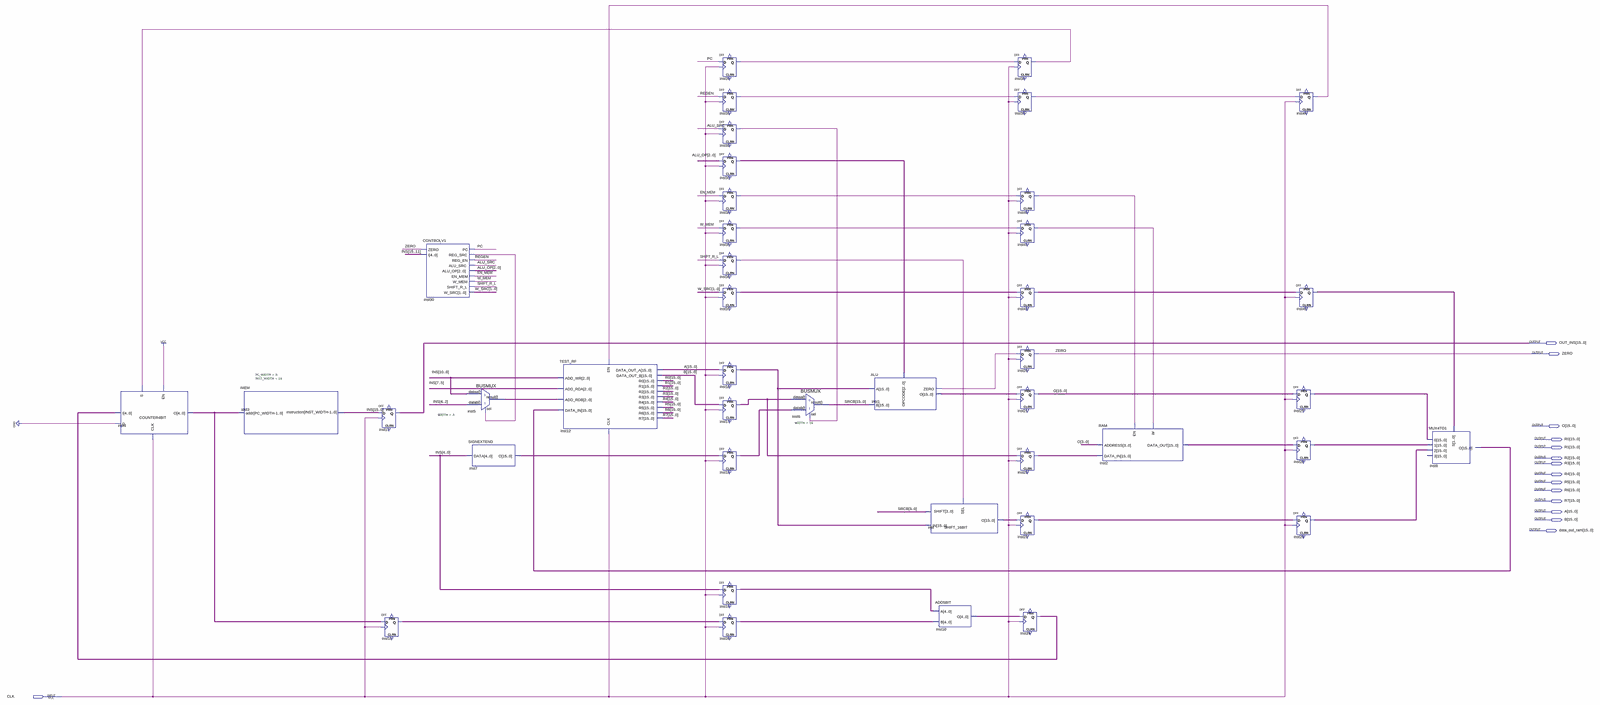
[diagram p0: schematic sheet, whole]
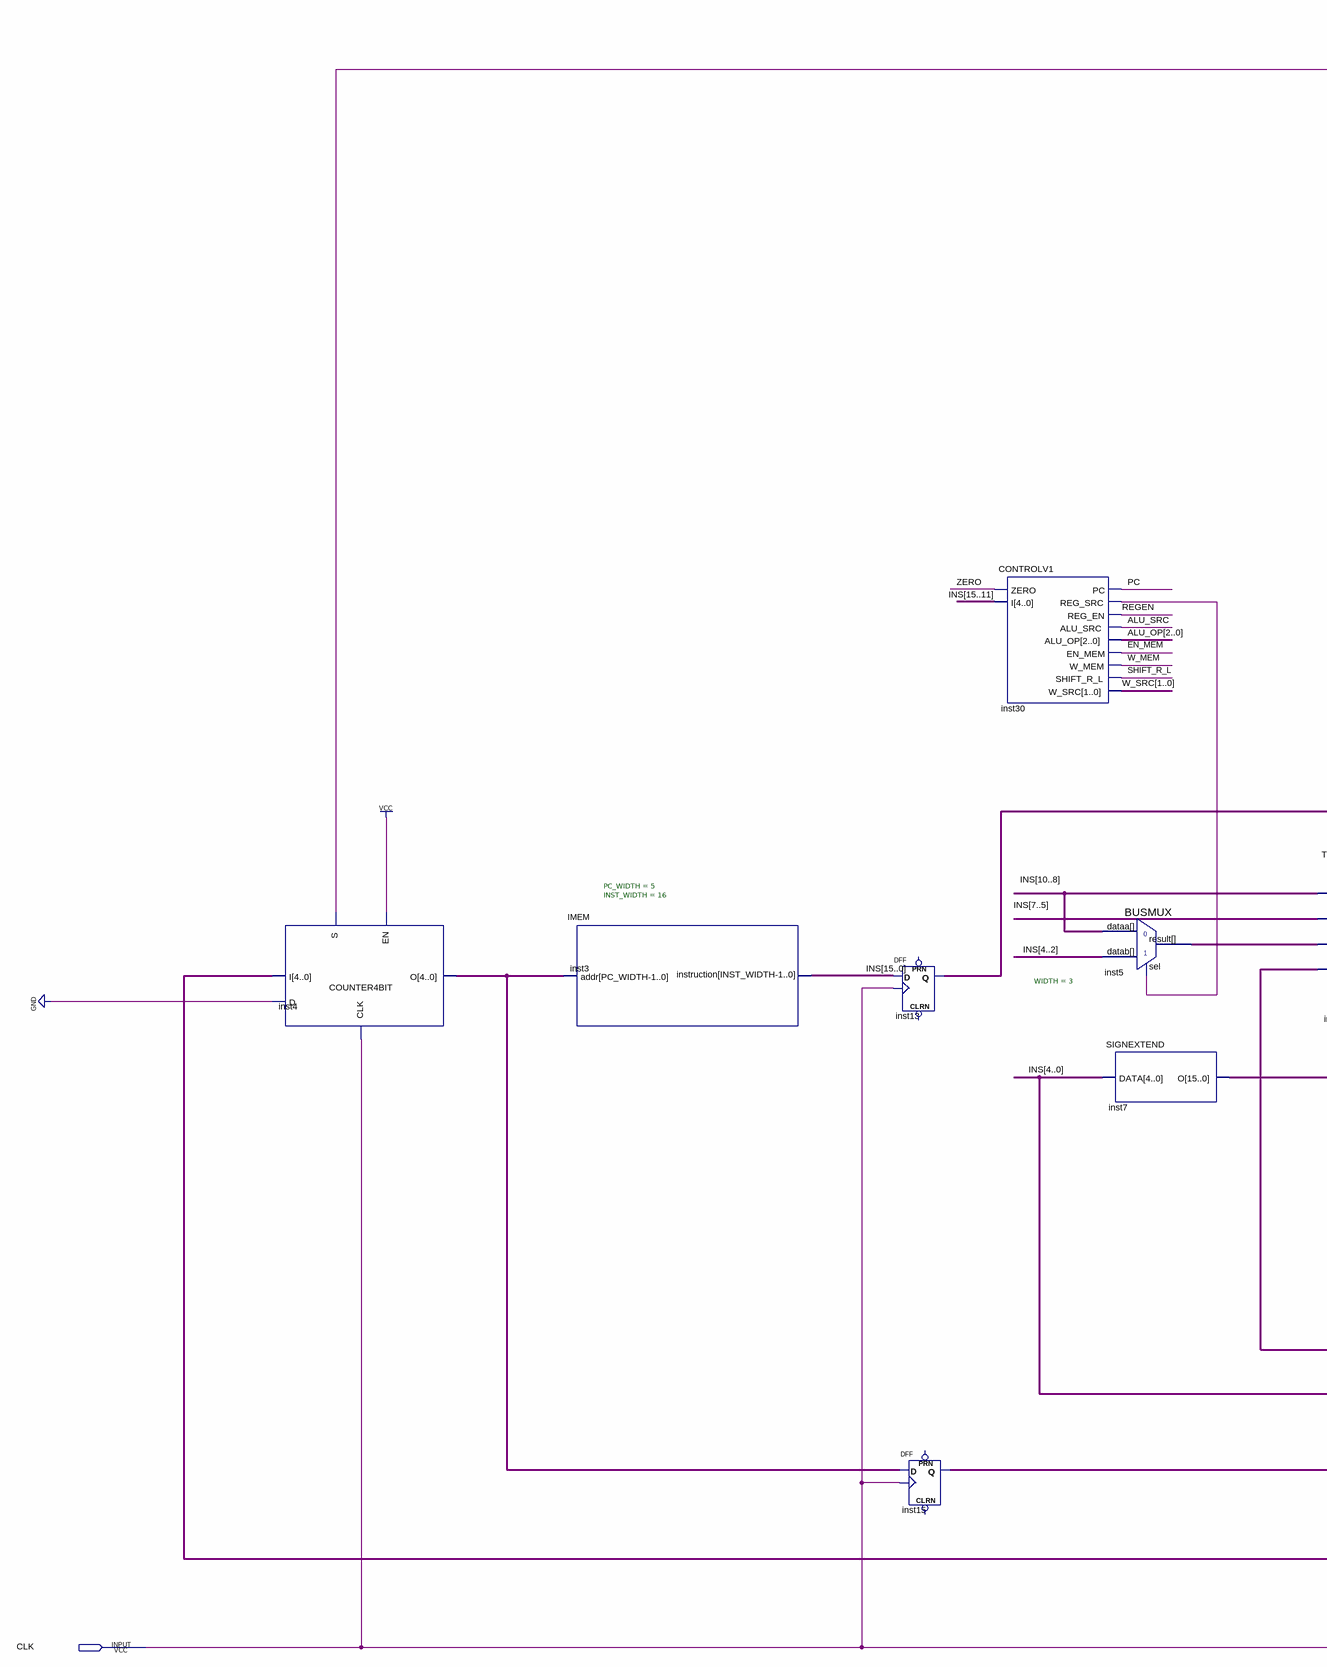
[diagram p1: schematic sheet, left part]
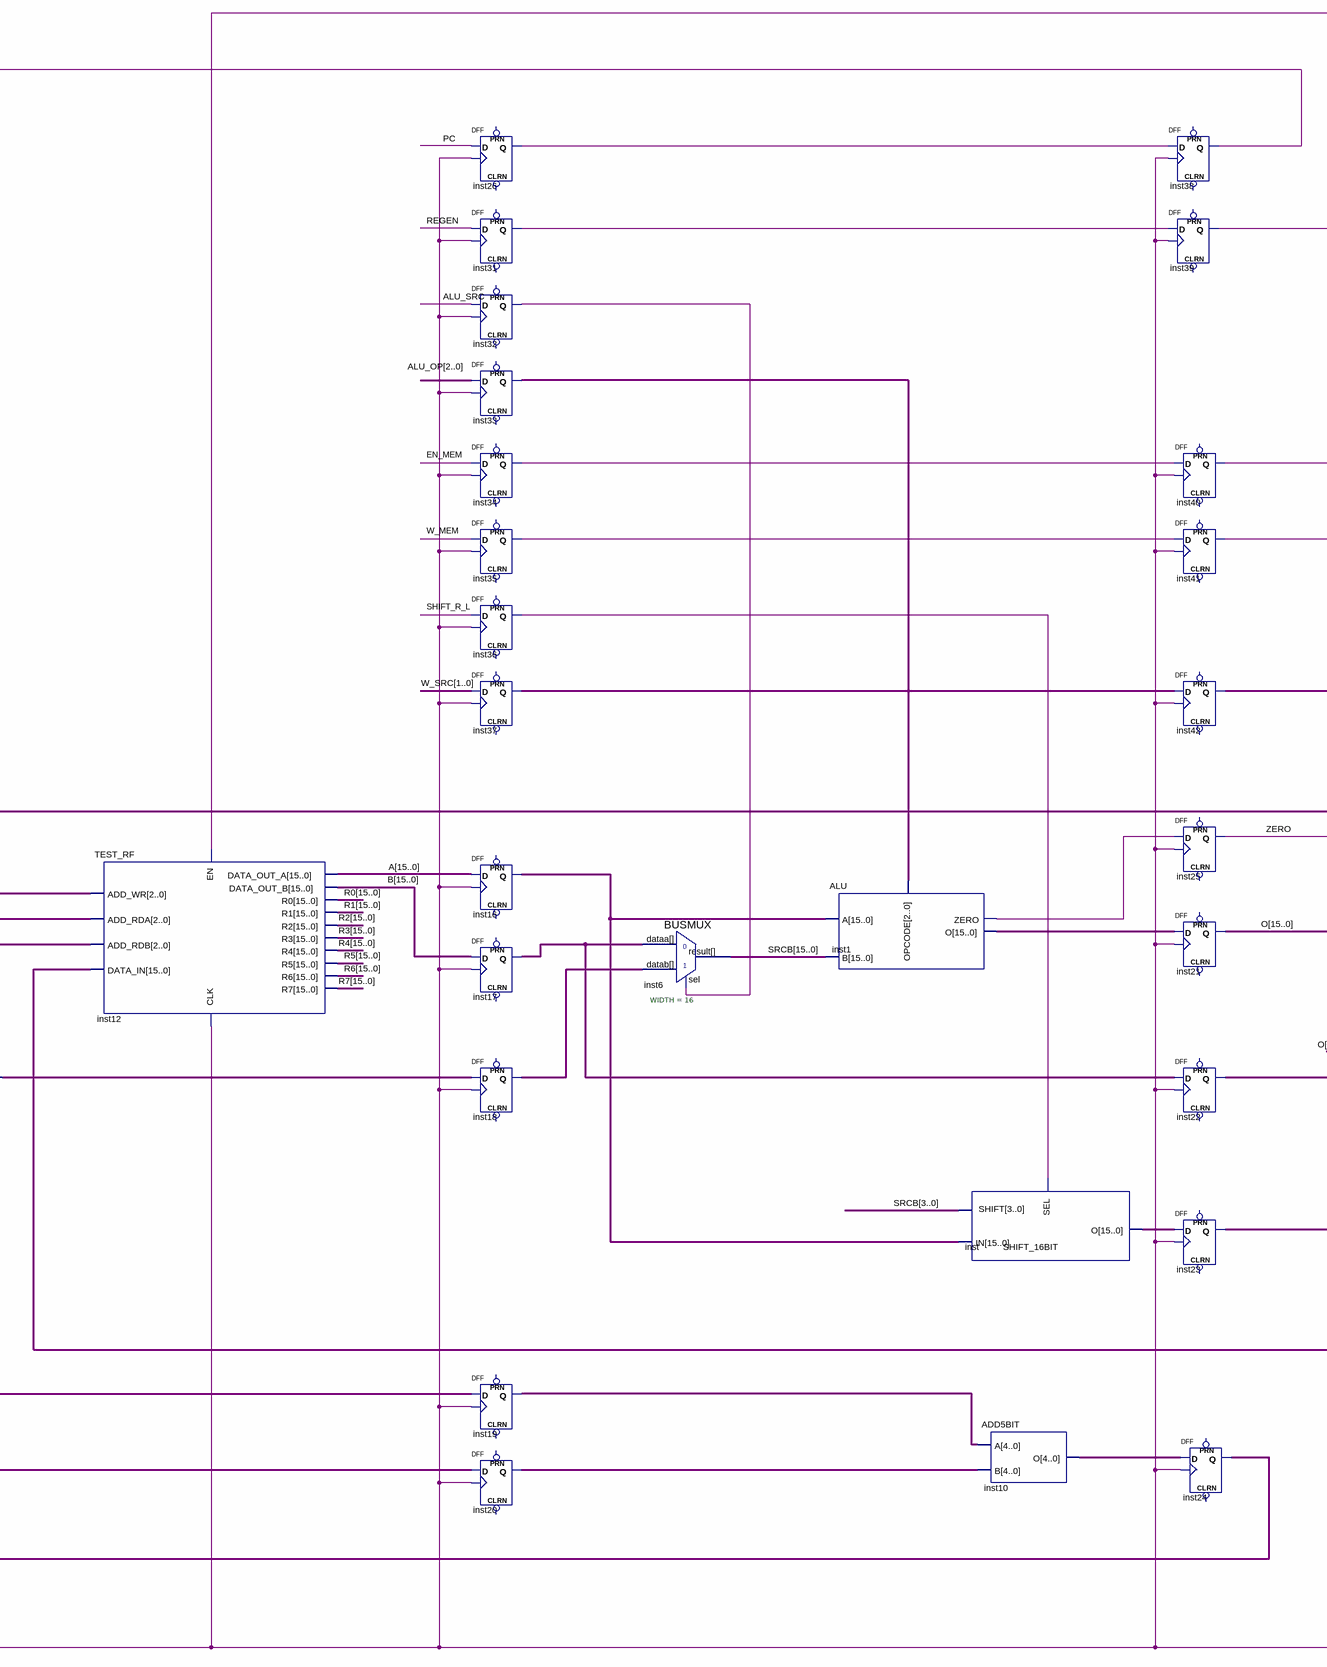
[diagram p2: schematic sheet, centre part]
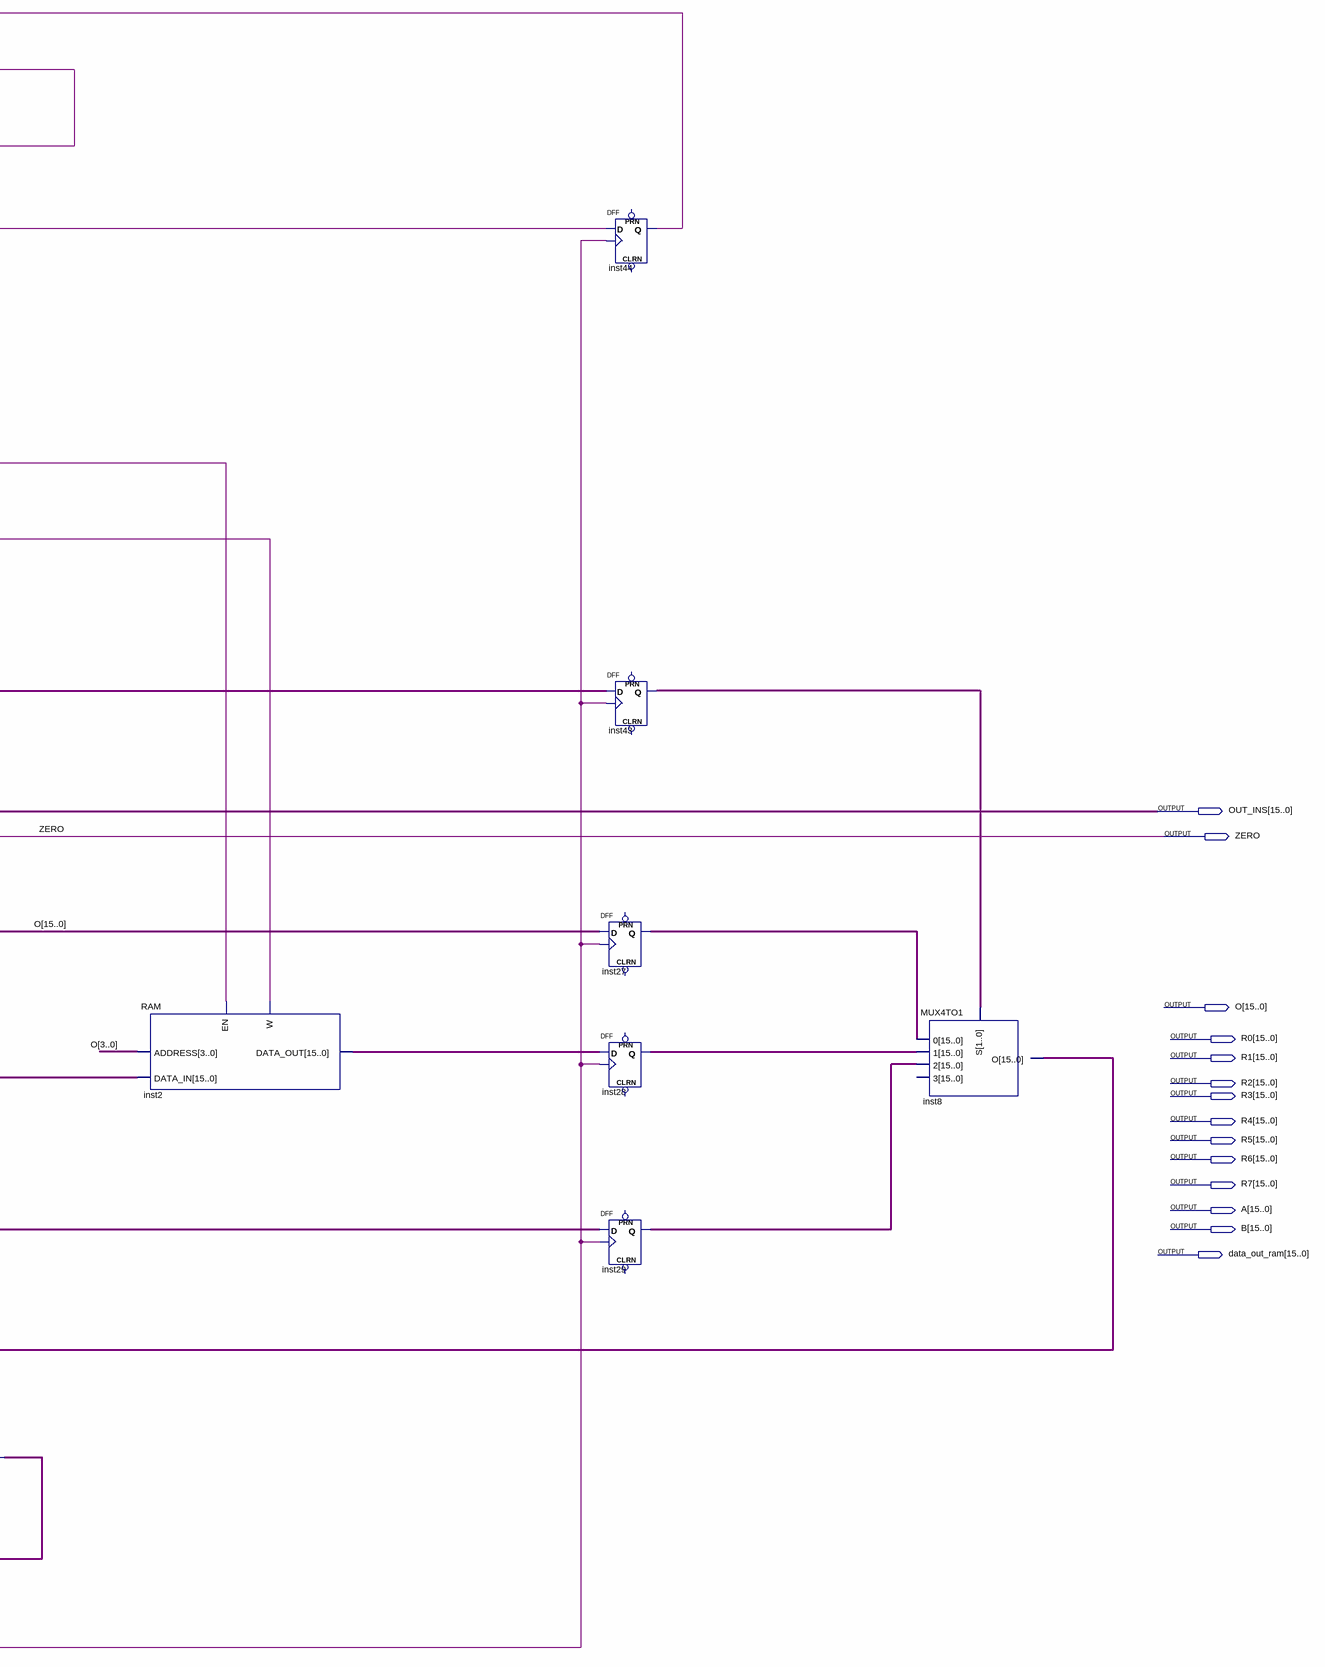
[diagram p3: schematic sheet, right part]
// Quartus schematic PIPELINE.bdf as structural Verilog: 42 symbols, 15 pins
module PIPELINE (
  input  CLK,
  output [15:0] OUT_INS,
  output ZERO,
  output [15:0] O,
  output [15:0] R0,
  output [15:0] R1,
  output [15:0] R2,
  output [15:0] R3,
  output [15:0] R4,
  output [15:0] R5,
  output [15:0] R6,
  output [15:0] R7,
  output [15:0] A,
  output [15:0] B,
  output [15:0] data_out_ram
);

  wire ALU_SRC, EN_MEM, inst1_zero, inst26_q, inst30_reg_src, inst31_q, inst32_q, inst34_q, inst35_q,
       inst36_q, inst38_q, inst39_q, inst40_q, inst41_q, inst44_q, PC, REGEN, SHIFT_R_L, W_MEM;
  wire [1:0] inst37_q, inst42_q, inst43_q, W_SRC;
  wire [2:0] ALU_OP, inst5_result, inst33_q;
  wire [4:0] inst4_o, inst10_o, inst15_q, inst19_q, inst20_q, inst24_q;
  wire [15:0] INS, inst1_o, inst2_data_out, inst7_o, inst8_o, inst16_q, inst17_q, inst18_q, inst22_q,
       inst23_q, inst27_q, inst28_q, inst29_q, inst_o, SRCB;

  COUNTER4BIT inst4 (.I(inst24_q), .S(inst38_q), .EN(1'b1), .D(1'b0), .CLK(CLK), .O(inst4_o));
  IMEM #(.PC_WIDTH(5), .INST_WIDTH(16)) inst3 (.addr(inst4_o), .instruction(INS));
  DFF inst13[15:0] (.CLK(CLK), .D(INS), .Q(OUT_INS));  // open: CLRN, PRN
  DFF inst15[4:0] (.CLK(CLK), .D(inst4_o), .Q(inst15_q));  // open: CLRN, PRN
  CONTROLV1 inst30 (
    .ZERO(ZERO), .I(INS[15:11]), .PC(PC), .REG_SRC(inst30_reg_src), .REG_EN(REGEN), .ALU_SRC(ALU_SRC),
    .ALU_OP(ALU_OP), .EN_MEM(EN_MEM), .W_MEM(W_MEM), .SHIFT_R_L(SHIFT_R_L), .W_SRC(W_SRC));
  BUSMUX #(.WIDTH(3)) inst5 (.datab(INS[4:2]), .sel(inst30_reg_src), .dataa(INS[10:8]), .result(inst5_result));
  SIGNEXTEND inst7 (.DATA(INS[4:0]), .O(inst7_o));
  TEST_RF inst12 (
    .DATA_IN(inst8_o), .ADD_RDA(INS[7:5]), .ADD_RDB(inst5_result), .ADD_WR(INS[10:8]), .EN(inst44_q),
    .CLK(CLK), .DATA_OUT_A(A), .DATA_OUT_B(B), .R0(R0), .R1(R1), .R2(R2), .R3(R3), .R4(R4), .R5(R5), .R6(R6),
    .R7(R7));
  DFF inst26 (.CLK(CLK), .D(PC), .Q(inst26_q));  // open: CLRN, PRN
  DFF inst31 (.CLK(CLK), .D(REGEN), .Q(inst31_q));  // open: CLRN, PRN
  DFF inst32 (.CLK(CLK), .D(ALU_SRC), .Q(inst32_q));  // open: CLRN, PRN
  DFF inst33[2:0] (.CLK(CLK), .D(ALU_OP), .Q(inst33_q));  // open: CLRN, PRN
  DFF inst34 (.CLK(CLK), .D(EN_MEM), .Q(inst34_q));  // open: CLRN, PRN
  DFF inst35 (.CLK(CLK), .D(W_MEM), .Q(inst35_q));  // open: CLRN, PRN
  DFF inst36 (.CLK(CLK), .D(SHIFT_R_L), .Q(inst36_q));  // open: CLRN, PRN
  DFF inst37[1:0] (.CLK(CLK), .D(W_SRC), .Q(inst37_q));  // open: CLRN, PRN
  DFF inst16[15:0] (.CLK(CLK), .D(A), .Q(inst16_q));  // open: CLRN, PRN
  DFF inst17[15:0] (.CLK(CLK), .D(B), .Q(inst17_q));  // open: CLRN, PRN
  DFF inst18[15:0] (.CLK(CLK), .D(inst7_o), .Q(inst18_q));  // open: CLRN, PRN
  DFF inst19[4:0] (.CLK(CLK), .D(INS[4:0]), .Q(inst19_q));  // open: CLRN, PRN
  DFF inst20[4:0] (.CLK(CLK), .D(inst15_q), .Q(inst20_q));  // open: CLRN, PRN
  BUSMUX #(.WIDTH(16)) inst6 (.datab(inst18_q), .sel(inst32_q), .dataa(inst17_q), .result(SRCB));
  ALU inst1 (.OPCODE(inst33_q), .A(inst16_q), .B(SRCB), .O(inst1_o), .ZERO(inst1_zero));
  SHIFT_16BIT inst (.SEL(inst36_q), .SHIFT(SRCB[3:0]), .IN(inst16_q), .O(inst_o));
  ADD5BIT inst10 (.A(inst19_q), .B(inst20_q), .O(inst10_o));
  DFF inst38 (.CLK(CLK), .D(inst26_q), .Q(inst38_q));  // open: CLRN, PRN
  DFF inst39 (.CLK(CLK), .D(inst31_q), .Q(inst39_q));  // open: CLRN, PRN
  DFF inst40 (.CLK(CLK), .D(inst34_q), .Q(inst40_q));  // open: CLRN, PRN
  DFF inst41 (.CLK(CLK), .D(inst35_q), .Q(inst41_q));  // open: CLRN, PRN
  DFF inst42[1:0] (.CLK(CLK), .D(inst37_q), .Q(inst42_q));  // open: CLRN, PRN
  DFF inst25 (.CLK(CLK), .D(inst1_zero), .Q(ZERO));  // open: CLRN, PRN
  DFF inst21[15:0] (.CLK(CLK), .D(inst1_o), .Q(O));  // open: CLRN, PRN
  DFF inst22[15:0] (.CLK(CLK), .D(inst17_q), .Q(inst22_q));  // open: CLRN, PRN
  DFF inst23[15:0] (.CLK(CLK), .D(inst_o), .Q(inst23_q));  // open: CLRN, PRN
  DFF inst24[4:0] (.CLK(CLK), .D(inst10_o), .Q(inst24_q));  // open: CLRN, PRN
  RAM inst2 (.DATA_IN(inst22_q), .W(inst41_q), .ADDRESS(O[3:0]), .EN(inst40_q), .DATA_OUT(inst2_data_out));
  DFF inst27[15:0] (.CLK(CLK), .D(O), .Q(inst27_q));  // open: CLRN, PRN
  DFF inst28[15:0] (.CLK(CLK), .D(inst2_data_out), .Q(inst28_q));  // open: CLRN, PRN
  DFF inst29[15:0] (.CLK(CLK), .D(inst23_q), .Q(inst29_q));  // open: CLRN, PRN
  DFF inst44 (.CLK(CLK), .D(inst39_q), .Q(inst44_q));  // open: CLRN, PRN
  DFF inst43[1:0] (.CLK(CLK), .D(inst42_q), .Q(inst43_q));  // open: CLRN, PRN
  MUX4TO1 inst8 (.\0 (inst27_q), .\1 (inst28_q), .\2 (inst29_q), .S(inst43_q), .O(inst8_o));  // open: 3
endmodule
